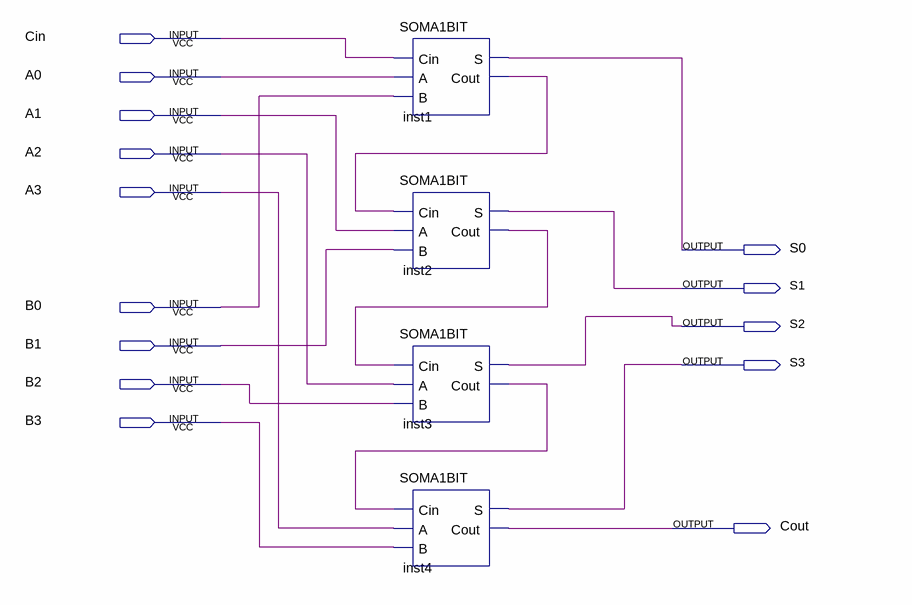
[diagram p0: schematic sheet]
// Quartus schematic SOMA4BITS.bdf as structural Verilog: 4 symbols, 14 pins
module SOMA4BITS (
  input  Cin,
  input  A0,
  input  A1,
  input  A2,
  input  A3,
  input  B0,
  input  B1,
  input  B2,
  input  B3,
  output S0,
  output S1,
  output S2,
  output S3,
  output Cout
);

  wire inst1_cout, inst2_cout, inst3_cout;

  SOMA1BIT inst1 (.Cin(Cin), .A(A0), .B(B0), .S(S0), .Cout(inst1_cout));
  SOMA1BIT inst2 (.Cin(inst1_cout), .A(A1), .B(B1), .S(S1), .Cout(inst2_cout));
  SOMA1BIT inst3 (.Cin(inst2_cout), .A(A2), .B(B2), .S(S2), .Cout(inst3_cout));
  SOMA1BIT inst4 (.Cin(inst3_cout), .A(A3), .B(B3), .S(S3), .Cout(Cout));
endmodule
